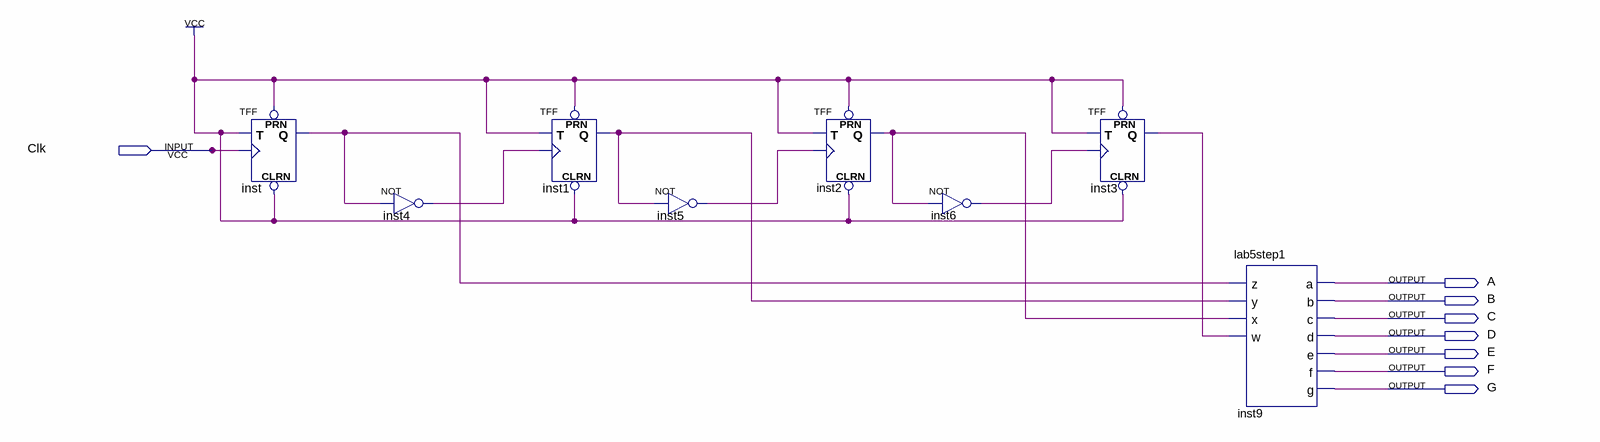
[diagram p0: schematic sheet]
// Quartus schematic Lab10step3a.bdf as structural Verilog: 8 symbols, 8 pins
module Lab10step3a (
  input  Clk,
  output A,
  output B,
  output C,
  output D,
  output E,
  output F,
  output G
);

  wire inst1_q, inst2_q, inst3_q, inst4_out, inst5_out, inst6_out, inst_q;

  TFF inst (.PRN(1'b1), .CLRN(1'b1), .T(1'b1), .CLK(Clk), .Q(inst_q));
  not inst4 (inst4_out, inst_q);
  TFF inst1 (.PRN(1'b1), .CLRN(1'b1), .T(1'b1), .CLK(inst4_out), .Q(inst1_q));
  not inst5 (inst5_out, inst1_q);
  TFF inst2 (.PRN(1'b1), .CLRN(1'b1), .T(1'b1), .CLK(inst5_out), .Q(inst2_q));
  not inst6 (inst6_out, inst2_q);
  TFF inst3 (.PRN(1'b1), .CLRN(1'b1), .T(1'b1), .CLK(inst6_out), .Q(inst3_q));
  lab5step1 inst9 (.z(inst_q), .x(inst2_q), .w(inst3_q), .y(inst1_q), .a(A), .b(B), .c(C), .d(D), .e(E), .f(F), .g(G));
endmodule
